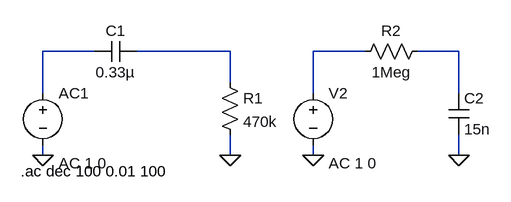
[diagram p0: schematic Week_1_quiz.asc]
Week_1_quiz.asc, the LTspice schematic file:
Version 4
SHEET 1 880 680
WIRE -32 128 -112 128
WIRE 176 128 32 128
WIRE 384 128 304 128
WIRE 528 128 464 128
WIRE 176 176 176 128
WIRE -112 192 -112 128
WIRE 304 192 304 128
WIRE 528 192 528 128
WIRE -112 288 -112 272
WIRE 176 288 176 256
WIRE 304 288 304 272
WIRE 528 288 528 256
FLAG 176 288 0
FLAG -112 288 0
FLAG 304 288 0
FLAG 528 288 0
SYMBOL voltage -112 176 R0
WINDOW 123 24 124 Left 2
WINDOW 39 0 0 Left 0
SYMATTR InstName AC1
SYMATTR Value ""
SYMATTR Value2 AC 1 0
SYMBOL cap 32 112 R90
WINDOW 0 0 32 VBottom 2
WINDOW 3 32 32 VTop 2
SYMATTR InstName C1
SYMATTR Value 0.33µ
SYMBOL res 160 160 R0
SYMATTR InstName R1
SYMATTR Value 470k
SYMBOL voltage 304 176 R0
WINDOW 123 24 124 Left 2
WINDOW 39 0 0 Left 0
SYMATTR InstName V2
SYMATTR Value ""
SYMATTR Value2 AC 1 0
SYMBOL res 480 112 R90
WINDOW 0 0 56 VBottom 2
WINDOW 3 32 56 VTop 2
SYMATTR InstName R2
SYMATTR Value 1Meg
SYMBOL cap 512 192 R0
SYMATTR InstName C2
SYMATTR Value 15n
TEXT -146 312 Left 2 !.ac dec 100 0.01 100

The netlist it stands for:
* Week_1_quiz.asc
V§AC1 N001 0 AC 1 0
C1 N002 N001 0.33µ
R1 N002 0 470k
V2 N003 0 AC 1 0
R2 N004 N003 1Meg
C2 N004 0 15n
.ac dec 100 0.01 100
.backanno
.end